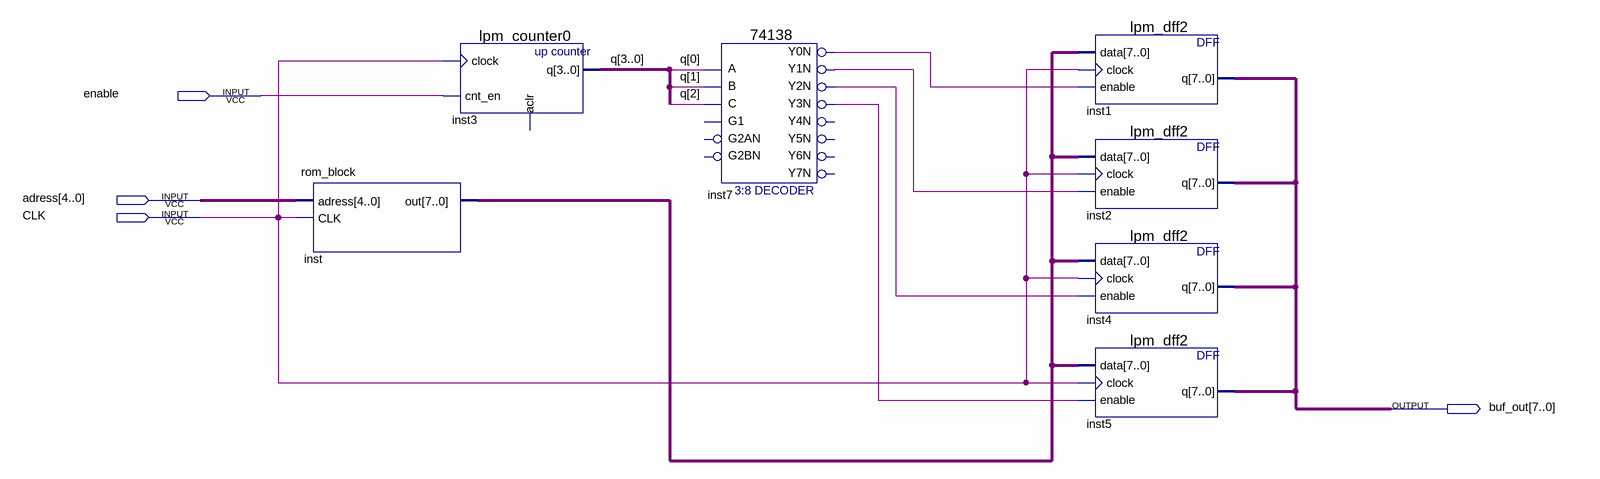
[diagram p0: schematic sheet]
// Quartus schematic Laba2.bdf as structural Verilog: 7 symbols, 4 pins
module Laba2 (
  input  enable,
  input  [4:0] adress,
  input  CLK,
  output [7:0] buf_out
);

  wire inst7_y0n, inst7_y1n, inst7_y2n, inst7_y3n;
  wire [3:0] q;
  wire [7:0] inst_out;

  rom_block inst (.adress(adress), .CLK(CLK), .out(inst_out));
  lpm_counter0 inst3 (.clock(CLK), .cnt_en(enable), .q(q));  // open: aclr
  \74138  inst7 (
    .A(q[0]), .B(q[1]), .C(q[2]), .Y0N(inst7_y0n), .Y1N(inst7_y1n), .Y2N(inst7_y2n), .Y3N(inst7_y3n));  // open: G1, G2AN, G2BN, Y4N, Y5N, Y6N, Y7N
  lpm_dff2 inst1 (.data(inst_out), .clock(CLK), .enable(inst7_y0n), .q(buf_out));
  lpm_dff2 inst2 (.data(inst_out), .clock(CLK), .enable(inst7_y1n), .q(buf_out));
  lpm_dff2 inst4 (.data(inst_out), .clock(CLK), .enable(inst7_y2n), .q(buf_out));
  lpm_dff2 inst5 (.data(inst_out), .clock(CLK), .enable(inst7_y3n), .q(buf_out));
endmodule
